# Altium project TFT_RA8876.PrjPcb
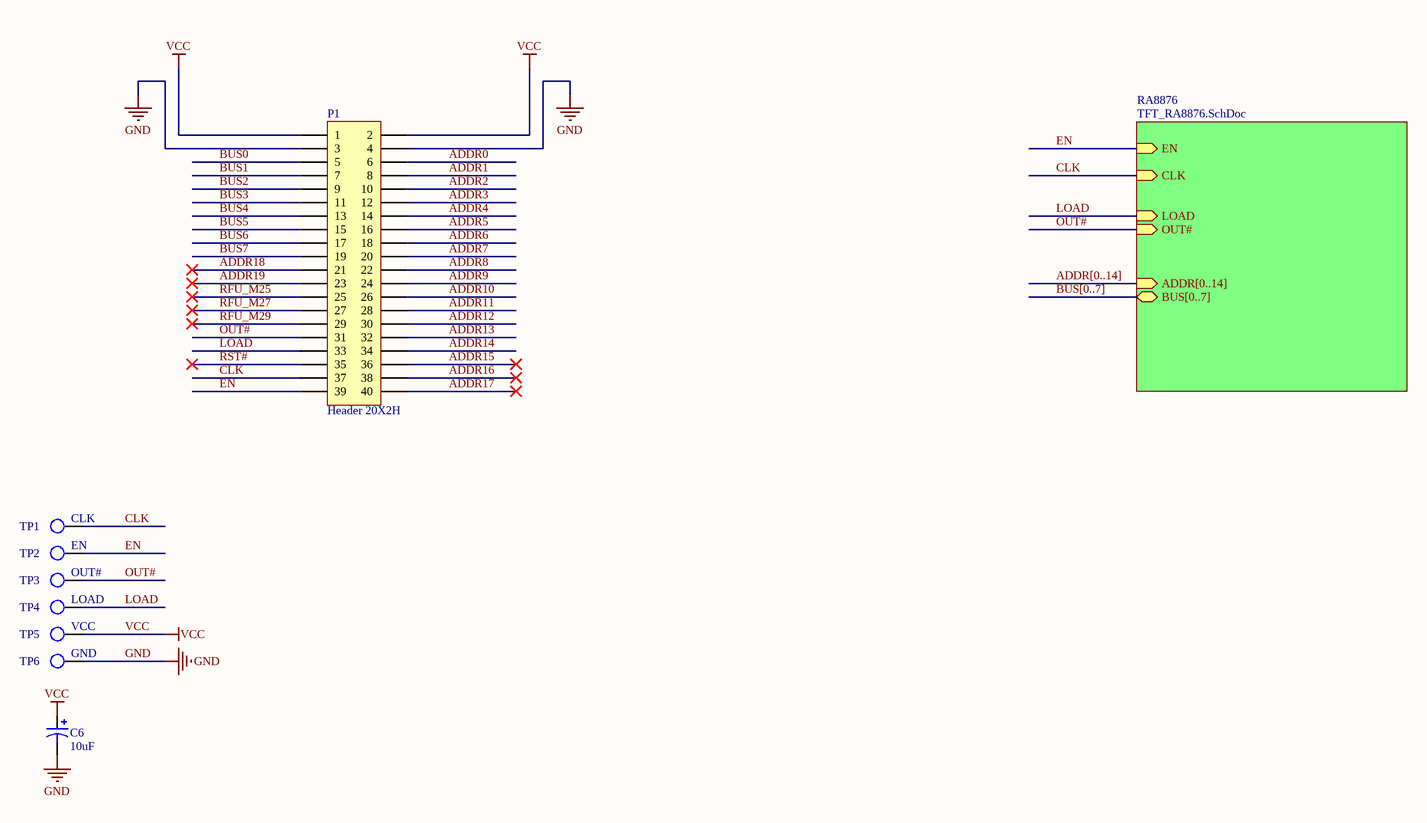
[diagram p0: Top.SchDoc]
2 sheets, 17 parts. Net scope: hierarchical (ports join the sheet entries above them; power ports are global).
Board file: TFT_RA8876.PcbDoc
Sheets:
  Top.SchDoc
    RA8876 = TFT_RA8876.SchDoc

## Sheet Top.SchDoc
size B; Author: E. Sims; Organization: Let's Build Rockets Inc.; SheetNumber: 1; SheetTotal: 2

### Parts
C6  value 10uF  [C5x7]  (hidden comment: Cap Pol5)
P1  Header 20X2H  [HDR2X20H]
TP1  CLK  [KSTN-5011_V]  (no BOM)
TP2  EN  [KSTN-5011_V]  (no BOM)
TP3  OUT#  [KSTN-5011_V]  (no BOM)
TP4  LOAD  [KSTN-5011_V]  (no BOM)
TP5  VCC  [KSTN-5011_V]  (no BOM)
TP6  GND  [KSTN-5011_V]  (no BOM)

### Sub-sheets
RA8876 = TFT_RA8876.SchDoc: LOAD (in), OUT# (in), EN (in), CLK (in), ADDR[0..14] (in), BUS[0..7] (bidir)

### Nets
GND: C6.2 P1.3 P1.4 TP6.1
VCC: C6.1 P1.1 P1.2 TP5.1
ADDR0: P1.6
ADDR1: P1.8
ADDR2: P1.10
ADDR3: P1.12
ADDR4: P1.14
ADDR5: P1.16
ADDR6: P1.18
ADDR7: P1.20
ADDR8: P1.22
ADDR9: P1.24
ADDR10: P1.26
ADDR11: P1.28
ADDR12: P1.30
ADDR13: P1.32
ADDR14: P1.34
ADDR15: P1.36
ADDR16: P1.38
ADDR17: P1.40
ADDR18: P1.21
ADDR19: P1.23
BUS0: P1.5
BUS1: P1.7
BUS2: P1.9
BUS3: P1.11
BUS4: P1.13
BUS5: P1.15
BUS6: P1.17
BUS7: P1.19
CLK: P1.37 TP1.1 ; sheet RA8876/CLK
EN: P1.39 TP2.1 ; sheet RA8876/EN
LOAD: P1.33 TP4.1 ; sheet RA8876/LOAD
OUT#: P1.31 TP3.1 ; sheet RA8876/OUT#
RFU_M25: P1.25
RFU_M27: P1.27
RFU_M29: P1.29
RST#: P1.35

### Buses and harness runs
bus ADDR[0..14] = sheet RA8876/ADDR[0..14]
bus BUS[0..7] = sheet RA8876/BUS[0..7]

### Notes on the sheet
- Let's Build Rocket's Inc. Modular Paylaod System Based on TMP-010 Rev
  For more information visit https://github.com/LetsBuildRockets/Modular-Payload-System
  This work is licensed under CC BY-NC 4.0. To view a copy of this license, visit https://creativecommons.org/licenses/by-nc/4.0
- Title
- Size:
- Date:
- Assembly Variant:
- B
- Number:
- Time:
- Revision:
- Sheet
- of
- Author:
- File:

### Library data of the parts
C6 = Cap Pol5: Polarized Capacitor; Published: 8-Jun-2000; LatestRevisionDate: 17-Jul-2002; LatestRevisionNote: Re-released for DXP Platform.; PackageReference: POLAR0.8; Publisher: Altium Limited; PackageDescription: Polarized Capacitor; 2 Leads
P1 = Header 20X2H: Header, 20-Pin, Dual row, Right Angle; System: Connector; LatestRevisionDate: 17-Jul-2002; LatestRevisionNote: Re-released for DXP Platform.; Publisher: Altium Limited
TP1-TP6 = TP

## Sheet TFT_RA8876.SchDoc
size B; Author: E. Sims; Organization: Let's Build Rockets Inc.; SheetNumber: 2; SheetTotal: 2
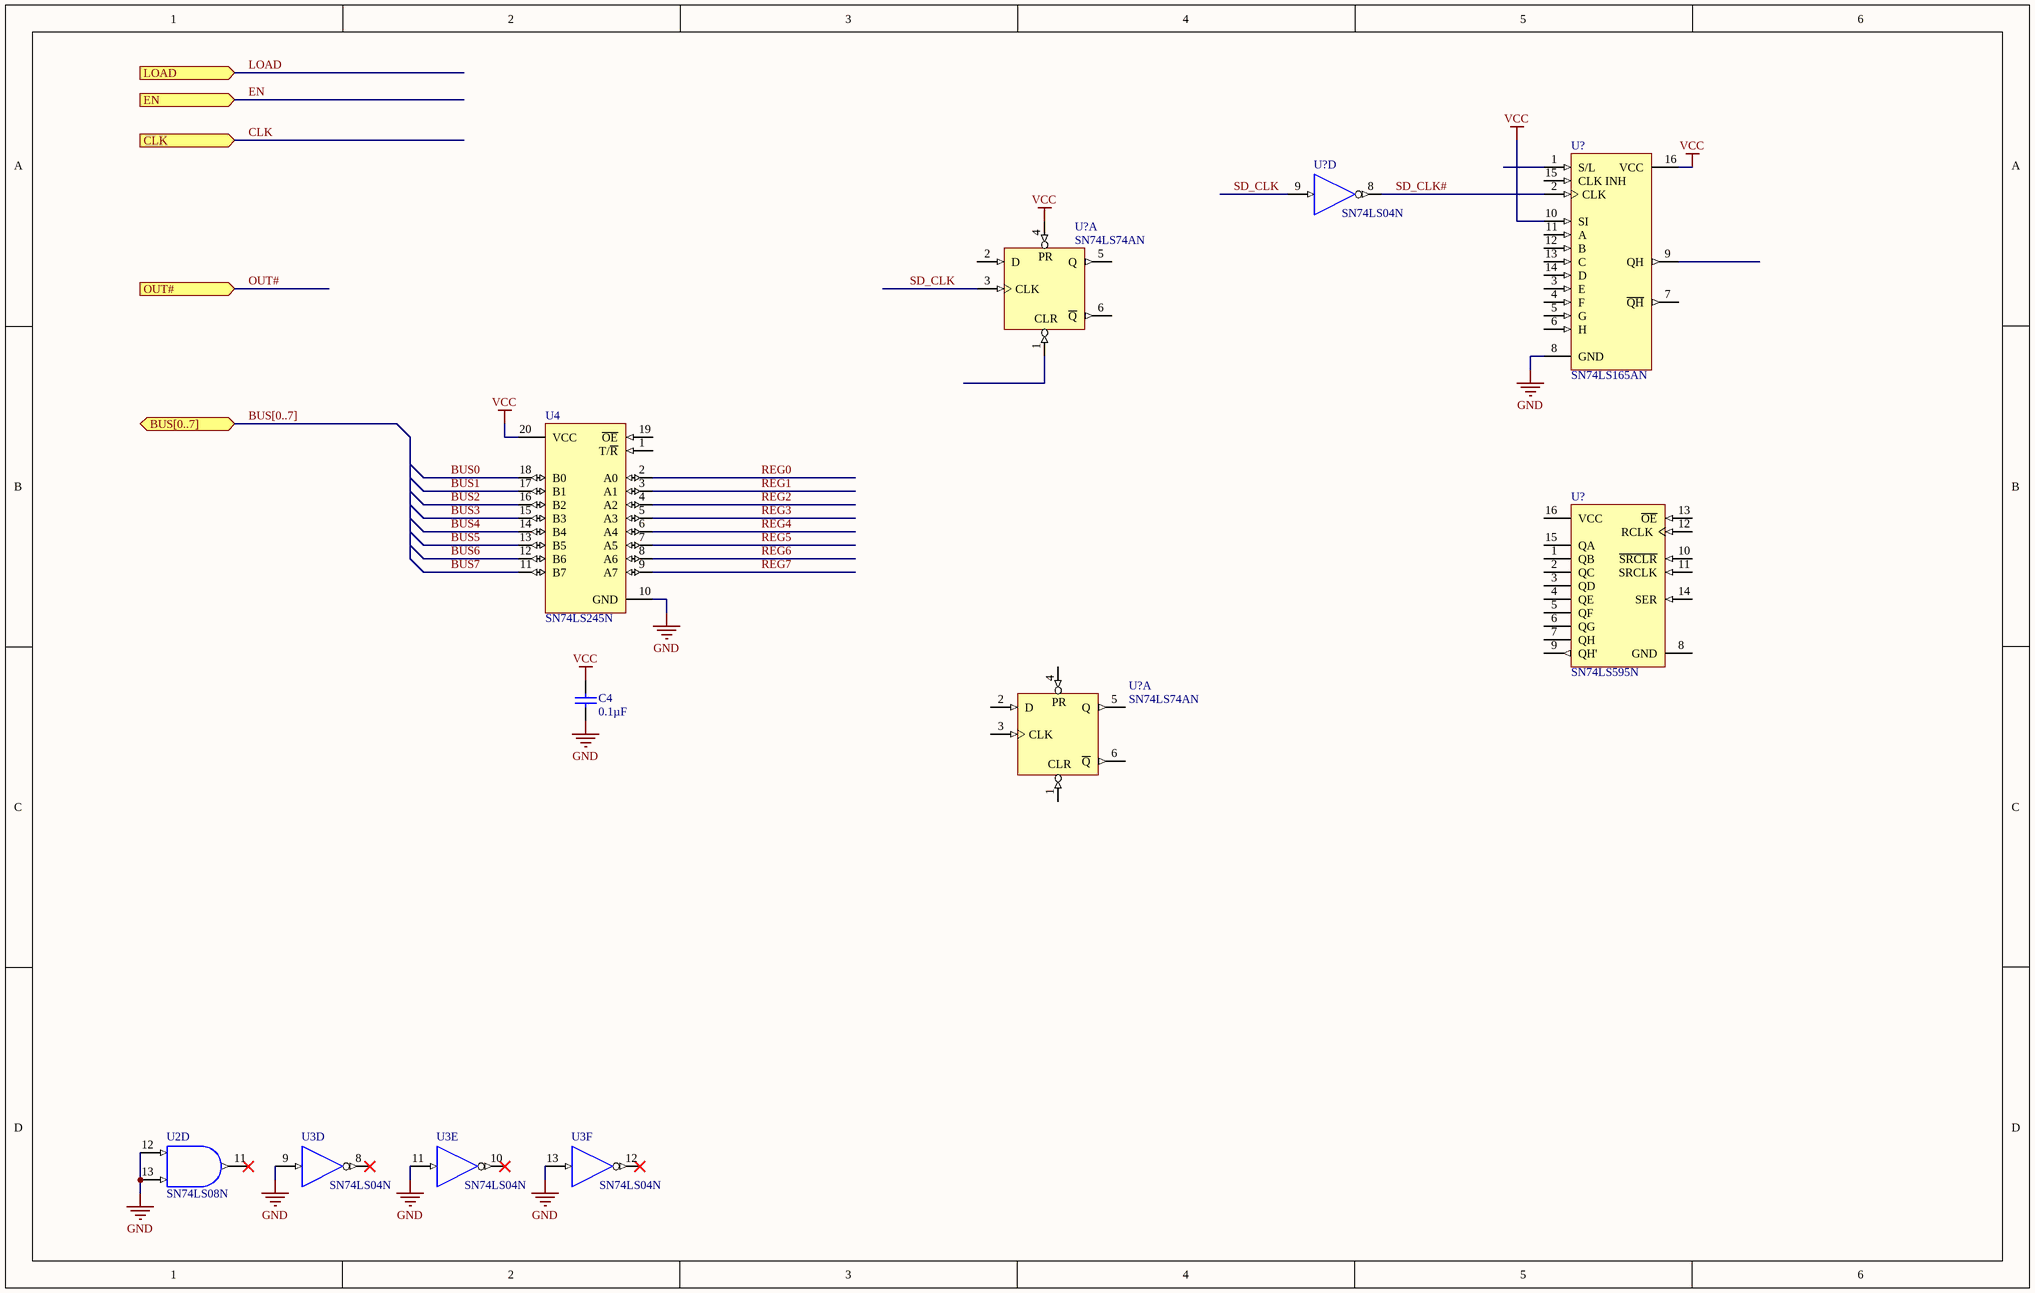
[diagram p1: TFT_RA8876.SchDoc]

### Parts
(Parts that share a designator on the sheet are numbered #1, #2 ... from top to bottom, then left to right.)
C4  Capacitance: 0.1µF  [VISH-K104K15X7RF5TL2]  (hidden comment: K104K15X7RF5TL2)
U2  SN74LS08N  [N014]  (part D of 4)
U3  SN74LS04N  [N014]  (parts D,E,F of 6)
U4  SN74LS245N  [N020]
U?#1  SN74LS165AN  [N016D]
U?#2  SN74LS04N  [N014]  (part D of 6)
U?#3  SN74LS74AN  [N014D]  (part A of 2)
U?#4  SN74LS595N  [N016]
U?#5  SN74LS74AN  [N014D]  (part A of 2)

### Ports
BUS[0..7] (bidir), CLK (in), EN (in), LOAD (in), OUT# (in)

### Nets
GND: C4.2 U2.7(GND) U2.12(A) U2.13(B) U3.7(GND) U3.9(A) U3.11(A) U3.13(A) U4.10(GND) U?#1.8(GND) U?#2.7(GND) U?#3.7(GND) U?#5.7(GND)
VCC: C4.1 U2.14(VCC) U3.14(VCC) U4.20(VCC) U?#1.10(SI) U?#1.16(VCC) U?#2.14(VCC) U?#3.4(PR) U?#3.14(VCC) U?#5.14(VCC)
BUS0: U4.18(B0)
BUS1: U4.17(B1)
BUS2: U4.16(B2)
BUS3: U4.15(B3)
BUS4: U4.14(B4)
BUS5: U4.13(B5)
BUS6: U4.12(B6)
BUS7: U4.11(B7)
REG0: U4.2(A0)
REG1: U4.3(A1)
REG2: U4.4(A2)
REG3: U4.5(A3)
REG4: U4.6(A4)
REG5: U4.7(A5)
REG6: U4.8(A6)
REG7: U4.9(A7)
SD_CLK: U?#2.9(A) U?#3.3(CLK)
SD_CLK#: U?#1.2(CLK) U?#2.8(Y)

Not connected (* = marked no-connect by the designer): U2 11(Y)*; U3 8(Y)* 10(Y)* 12(Y)*; U4 1(T/~{R}) 19(~{OE}); U?#1 1(S/L) 3(E) 4(F) 5(G) 6(H) 7(~{QH}) 9(QH) 11(A) 12(B) 13(C) 14(D) 15(CLK_INH); U?#3 1(CLR) 2(D) 5(Q) 6(~{Q}); U?#4 1(QB) 2(QC) 3(QD) 4(QE) 5(QF) 6(QG) 7(QH) 8(GND) 9(QH') 10(~{SRCLR}) 11(SRCLK) 12(RCLK) 13(~{OE}) 14(SER) 15(QA) 16(VCC); U?#5 1(CLR) 2(D) 3(CLK) 4(PR) 5(Q) 6(~{Q})

### Buses and harness runs
bus BUS[0..7] = port BUS[0..7]

### Notes on the sheet
- Let's Build Rocket's Inc. Modular Paylaod System Based on TMP-010 Rev
  For more information visit https://github.com/LetsBuildRockets/Modular-Payload-System
  This work is licensed under CC BY-NC 4.0. To view a copy of this license, visit https://creativecommons.org/licenses/by-nc/4.0
- Title
- Size:
- Date:
- Assembly Variant:
- B
- Number:
- Time:
- Revision:
- Sheet
- of
- Author:
- File:

### Library data of the parts
C4 = CMP-2000-06508-1: Ceramic Capacitor, 100 nF, +/- 10%, 50 V, -55 to 125 degC, 2-Pin THD, RoHS, Tape and Reel; Manufacturer: Vishay; Other Names: BC1084CT; Catalog Drawings: Mono-KapSide2-15_5.58Mono-KapSide1_15; Temperature Coefficient: X7R; Voltage - Rated: 50V; Online Catalog: Mono-Kap™Series; Size / Dimension: 0.157"Lx0.098"W(4.00mmx2.50mm); Operating Temperature: -55°C~125°C; Family: CeramicCapacitors; Manufacturer URL: http://www.vishay.com/; Standard Package: 1; Thickness (Max): -; Ratings: -; Datasheet Version: 08/2013; Package Description: 2-Pin Through Hole Device, Body 4 x 2.6 mm; Mounting Type: ThroughHole; Features: -; Lead Spacing: 0.098"(2.50mm); Tolerance: ±10%; Category: Capacitors; Mounting Technology: ThroughHole; Lead Style: Straight; Datasheet URL: http://www.vishay.com/docs/45171/kseries.pdf; Applications: GeneralPurpose; Package / Case: Radial; Height - Seated (Max): 0.220"(5.58mm); Package Reference: K104K15X7RF5TL2; Series: Mono-Kap™K; Packaging: CutTape(CT)
U2 = SN74LS08N: Quadruple 2-Input Positive-AND Gate; Published: 8-Jun-2000; LatestRevisionDate: 04-Mar-2005; LatestRevisionNote: Stylized 3D Model Added.; DatasheetVersion: Mar-1988; PackageVersion: Oct-1995; PackageReference: N014; Publisher: Altium Limited; PackageDescription: DIP; 14 Leads; Row Spacing 7.62 mm; Pitch 2.54 mm; ComponentLink1Description: Manufacturer Link; ComponentLink1URL: http://www.ti.com/; ComponentLink2Description: Datasheet; ComponentLink2URL: http://www-s.ti.com/sc/ds/SN74LS08.pdf
U3 U?#2 = SN74LS04N: Hex Inverter; Published: 8-Jun-2000; LatestRevisionDate: 04-Mar-2005; LatestRevisionNote: Stylized 3D Model Added.; DatasheetVersion: Mar-1988; PackageVersion: Oct-1995; PackageReference: N014; Publisher: Altium Limited; PackageDescription: DIP; 14 Leads; Row Spacing 7.62 mm; Pitch 2.54 mm; ComponentLink1Description: Manufacturer Link; ComponentLink1URL: http://www.ti.com/; ComponentLink2Description: Datasheet; ComponentLink2URL: http://www-s.ti.com/sc/ds/sn74ls04.pdf
U4 = SN74LS245N: Octal Bus Transceiver with 3-State Outputs; Published: 8-Jun-2000; LatestRevisionDate: 04-Mar-2005; LatestRevisionNote: Stylized 3D Model Added.; DatasheetVersion: Mar-1988; PackageVersion: Oct-1995; PackageReference: N020; Publisher: Altium Limited; PackageDescription: DIP; 20 Leads; Row Spacing 7.62 mm; Pitch 2.54 mm; ComponentLink1Description: Manufacturer Link; ComponentLink1URL: http://www.ti.com/; ComponentLink2Description: Datasheet; ComponentLink2URL: http://www-s.ti.com/sc/ds/sn74ls245.pdf
U?#1 = SN74LS165AN: Parallel-Load 8-Bit Shift Register; Published: 8-Jun-2000; LatestRevisionDate: 04-Mar-2005; LatestRevisionNote: Stylized 3D Model Added.; DatasheetVersion: Mar-1988; PackageVersion: Oct-1995; PackageReference: N016D; Publisher: Altium Limited; PackageDescription: DIP; 16 Leads; Row Spacing 7.62 mm; Pitch 2.54 mm; Code_JEDEC: MS-001-BB; ComponentLink1Description: Manufacturer Link; ComponentLink1URL: http://www.ti.com/
U?#3 U?#5 = SN74LS74AN: Dual D-Type Positive-Edge-Triggered Flip-Flop with Preset and Clear; Published: 8-Jun-2000; LatestRevisionDate: 04-Mar-2005; LatestRevisionNote: Stylized 3D Model Added.; DatasheetVersion: Mar-1988; PackageVersion: Oct-1995; PackageReference: N014D; Publisher: Altium Limited; PackageDescription: DIP; 14 Leads; Row Spacing 7.62 mm; Pitch 2.54 mm; ComponentLink1Description: Manufacturer Link; ComponentLink1URL: http://www.ti.com/; ComponentLink2Description: Datasheet; ComponentLink2URL: http://www-s.ti.com/sc/ds/sn74ls74a.pdf
U?#4 = SN74LS595N: 8-Bit Shift Register with Output Latch; Published: 8-Jun-2000; LatestRevisionDate: 04-Mar-2005; LatestRevisionNote: Stylized 3D Model Added.; DatasheetVersion: Mar-1988; PackageVersion: Oct-1995; PackageReference: N016; Publisher: Altium Limited; PackageDescription: DIP; 16 Leads; Row Spacing 7.62 mm; Pitch 2.54 mm; Code_JEDEC: MS-001-BB; ComponentLink1Description: Manufacturer Link; ComponentLink1URL: http://www.ti.com/; ComponentLink2Description: Datasheet; ComponentLink2URL: http://www-s.ti.com/sc/ds/sn74ls596.pdf

## Nets that join several sheets
GND: Top (C6.2 P1.3 P1.4 TP6.1), TFT_RA8876 (13 pins)
VCC: Top (C6.1 P1.1 P1.2 TP5.1), TFT_RA8876 (10 pins)
BUS0: Top (P1.5), TFT_RA8876 (U4.18)
BUS1: Top (P1.7), TFT_RA8876 (U4.17)
BUS2: Top (P1.9), TFT_RA8876 (U4.16)
BUS3: Top (P1.11), TFT_RA8876 (U4.15)
BUS4: Top (P1.13), TFT_RA8876 (U4.14)
BUS5: Top (P1.15), TFT_RA8876 (U4.13)
BUS6: Top (P1.17), TFT_RA8876 (U4.12)
BUS7: Top (P1.19), TFT_RA8876 (U4.11)